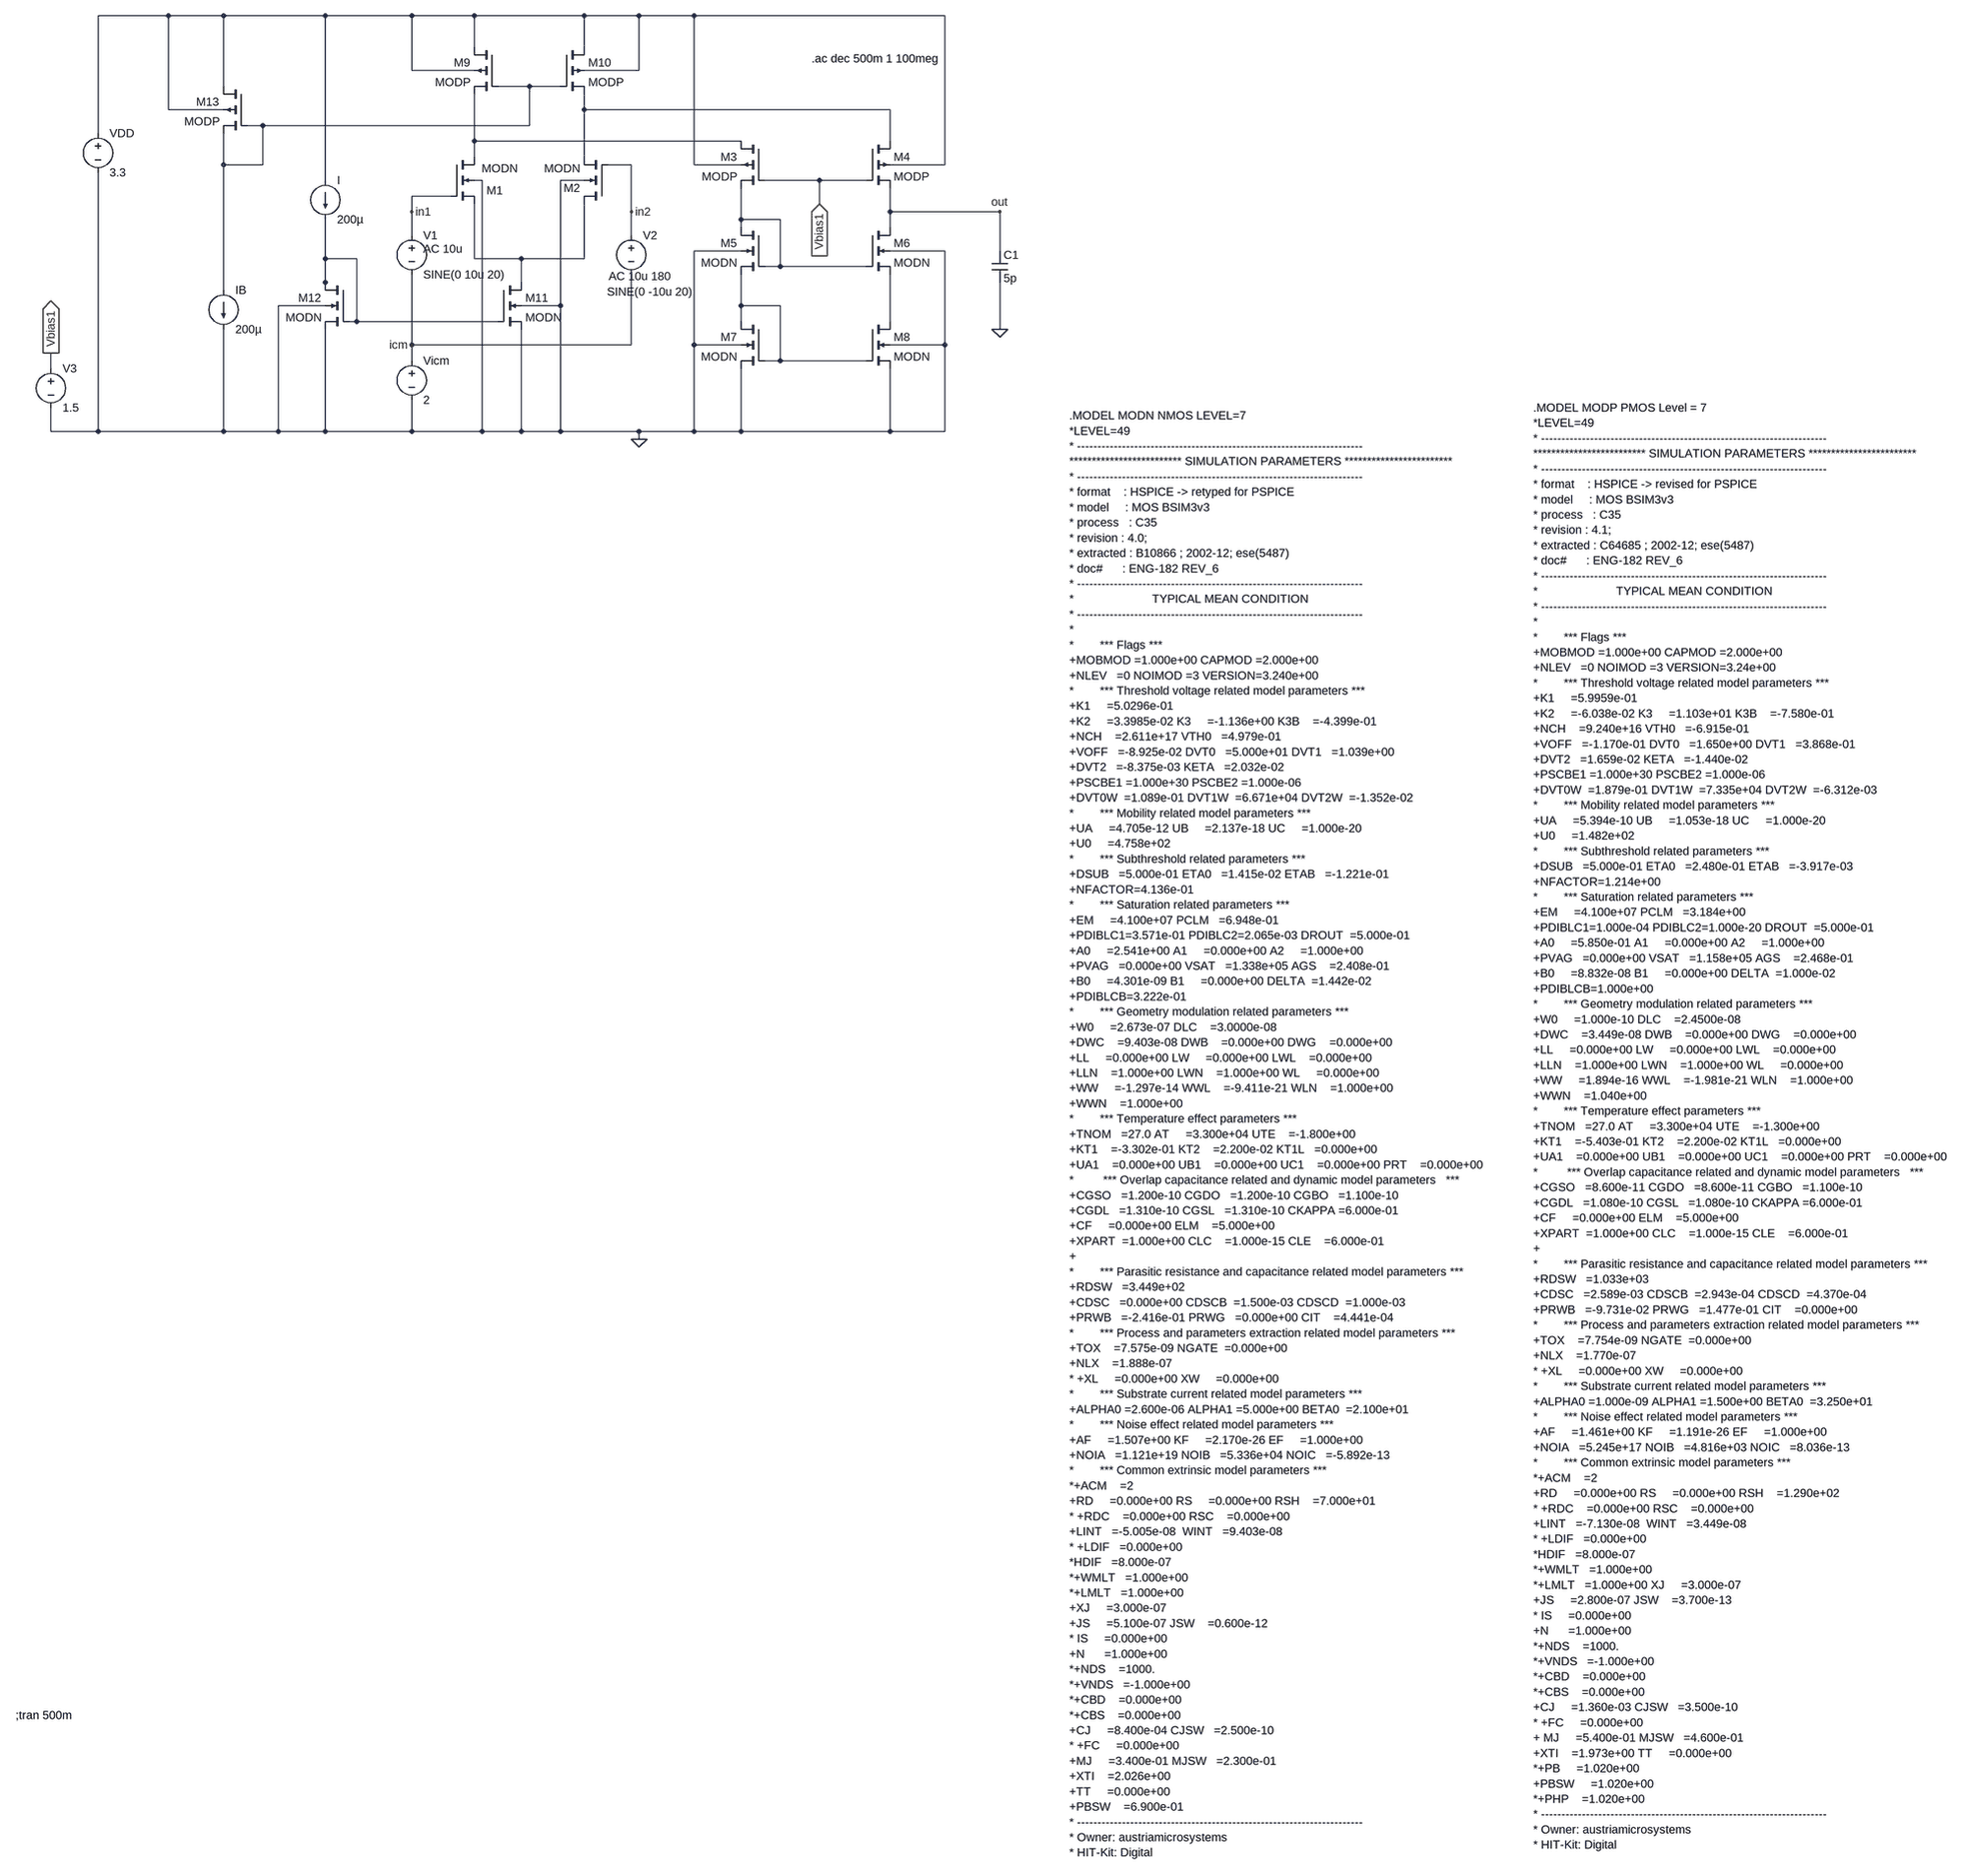
[diagram p0: schematic Ota.asc]
Ota.asc, the LTspice schematic file:
Version 4
SHEET 1 2256 2892
WIRE -1648 -592 -1792 -592
WIRE -1536 -592 -1648 -592
WIRE -1328 -592 -1536 -592
WIRE -1152 -592 -1328 -592
WIRE -1024 -592 -1152 -592
WIRE -800 -592 -1024 -592
WIRE -688 -592 -800 -592
WIRE -576 -592 -688 -592
WIRE -64 -592 -576 -592
WIRE -1024 -528 -1024 -592
WIRE -800 -528 -800 -592
WIRE -1152 -480 -1152 -592
WIRE -1024 -480 -1152 -480
WIRE -688 -480 -688 -592
WIRE -688 -480 -800 -480
WIRE -1536 -448 -1536 -592
WIRE -912 -448 -976 -448
WIRE -848 -448 -912 -448
WIRE -1648 -400 -1648 -592
WIRE -1536 -400 -1648 -400
WIRE -800 -400 -800 -432
WIRE -176 -400 -800 -400
WIRE -1456 -368 -1488 -368
WIRE -912 -368 -912 -448
WIRE -912 -368 -1456 -368
WIRE -1792 -352 -1792 -592
WIRE -1024 -336 -1024 -432
WIRE -480 -336 -1024 -336
WIRE -176 -336 -176 -400
WIRE -1024 -304 -1024 -336
WIRE -800 -304 -800 -400
WIRE -1536 -288 -1536 -352
WIRE -1456 -288 -1456 -368
WIRE -1456 -288 -1536 -288
WIRE -704 -288 -752 -288
WIRE -576 -288 -576 -592
WIRE -480 -288 -576 -288
WIRE -64 -288 -64 -592
WIRE -64 -288 -176 -288
WIRE -1328 -256 -1328 -592
WIRE -1008 -256 -1024 -256
WIRE -800 -256 -848 -256
WIRE -320 -256 -432 -256
WIRE -224 -256 -320 -256
WIRE -1072 -224 -1152 -224
WIRE -320 -208 -320 -256
WIRE -1152 -192 -1152 -224
WIRE -704 -192 -704 -288
WIRE -176 -192 -176 -240
WIRE 48 -192 -176 -192
WIRE -480 -176 -480 -240
WIRE -400 -176 -480 -176
WIRE -480 -160 -480 -176
WIRE -176 -160 -176 -192
WIRE -1152 -144 -1152 -192
WIRE -704 -144 -704 -192
WIRE -480 -112 -576 -112
WIRE -64 -112 -176 -112
WIRE 48 -112 48 -192
WIRE -1328 -96 -1328 -176
WIRE -1264 -96 -1328 -96
WIRE -1024 -96 -1024 -208
WIRE -928 -96 -1024 -96
WIRE -800 -96 -800 -208
WIRE -800 -96 -928 -96
WIRE -400 -80 -400 -176
WIRE -400 -80 -432 -80
WIRE -224 -80 -400 -80
WIRE -1328 -48 -1328 -96
WIRE -928 -48 -928 -96
WIRE -1536 -32 -1536 -288
WIRE -1328 -32 -1328 -48
WIRE -1328 0 -1424 0
WIRE -848 0 -848 -256
WIRE -848 0 -928 0
WIRE -480 0 -480 -64
WIRE -400 0 -480 0
WIRE -1264 32 -1264 -96
WIRE -1264 32 -1280 32
WIRE -976 32 -1264 32
WIRE -480 32 -480 0
WIRE -176 32 -176 -64
WIRE 48 48 48 -48
WIRE -1152 80 -1152 -64
WIRE -704 80 -704 -64
WIRE -704 80 -1152 80
WIRE -576 80 -576 -112
WIRE -480 80 -576 80
WIRE -64 80 -64 -112
WIRE -64 80 -176 80
WIRE -1152 112 -1152 80
WIRE -400 112 -400 0
WIRE -400 112 -432 112
WIRE -224 112 -400 112
WIRE -1888 128 -1888 96
WIRE -1888 256 -1888 208
WIRE -1792 256 -1792 -272
WIRE -1792 256 -1888 256
WIRE -1536 256 -1536 48
WIRE -1536 256 -1792 256
WIRE -1424 256 -1424 0
WIRE -1424 256 -1536 256
WIRE -1328 256 -1328 48
WIRE -1328 256 -1424 256
WIRE -1152 256 -1152 192
WIRE -1152 256 -1328 256
WIRE -1008 256 -1008 -256
WIRE -1008 256 -1152 256
WIRE -928 256 -928 48
WIRE -928 256 -1008 256
WIRE -848 256 -848 0
WIRE -848 256 -928 256
WIRE -688 256 -848 256
WIRE -576 256 -576 80
WIRE -576 256 -688 256
WIRE -480 256 -480 128
WIRE -480 256 -576 256
WIRE -176 256 -176 128
WIRE -176 256 -480 256
WIRE -64 256 -64 80
WIRE -64 256 -176 256
WIRE -688 272 -688 256
FLAG -688 272 0
FLAG -320 -208 Vbias1
IOPIN -320 -208 In
FLAG 48 -192 out
FLAG -1888 96 Vbias1
IOPIN -1888 96 Out
FLAG 48 48 0
FLAG -704 -192 in2
FLAG -1152 -192 in1
FLAG -1152 80 icm
SYMBOL nmos4 -752 -208 R180
SYMATTR InstName M2
SYMATTR Value MODN
SYMATTR Value2 l=1.4u w=44.8u
SYMBOL nmos4 -1072 -304 R0
WINDOW 0 73 69 Left 2
WINDOW 3 63 24 Left 2
SYMATTR InstName M1
SYMATTR Value MODN
SYMATTR Value2 l=1.4u w=44.8u
SYMBOL pmos4 -224 -336 R0
SYMATTR InstName M4
SYMATTR Value MODP
SYMATTR Value2 l=1.4u w=168u
SYMBOL nmos4 -224 -160 R0
SYMATTR InstName M6
SYMATTR Value MODN
SYMATTR Value2 l=1.4u w=67.2u
SYMBOL nmos4 -224 32 R0
SYMATTR InstName M8
SYMATTR Value MODN
SYMATTR Value2 l=1.4u w=67.2u
SYMBOL pmos4 -848 -528 R0
SYMATTR InstName M10
SYMATTR Value MODP
SYMATTR Value2 l=1.4u w=280u
SYMBOL nmos4 -976 -48 R0
SYMATTR InstName M11
SYMATTR Value MODN
SYMATTR Value2 l=1.4u w=89.6u
SYMBOL voltage -1792 -368 R0
WINDOW 123 0 0 Left 2
WINDOW 39 0 0 Left 2
SYMATTR InstName VDD
SYMATTR Value 3.3
SYMBOL pmos4 -432 -336 M0
SYMATTR InstName M3
SYMATTR Value MODP
SYMATTR Value2 l=1.4u w=168u
SYMBOL pmos4 -976 -528 M0
SYMATTR InstName M9
SYMATTR Value MODP
SYMATTR Value2 l=1.4u w=280u
SYMBOL nmos4 -432 -160 M0
SYMATTR InstName M5
SYMATTR Value MODN
SYMATTR Value2 l=1.4u w=67.2u
SYMBOL nmos4 -432 32 M0
SYMATTR InstName M7
SYMATTR Value MODN
SYMATTR Value2 l=1.4u w=67.2u
SYMBOL nmos4 -1280 -48 M0
SYMATTR InstName M12
SYMATTR Value MODN
SYMATTR Value2 l=1.4u w=89.6u
SYMBOL current -1328 -256 R0
WINDOW 123 0 0 Left 2
WINDOW 39 0 0 Left 2
SYMATTR InstName I
SYMATTR Value 200µ
SYMBOL pmos4 -1488 -448 M0
SYMATTR InstName M13
SYMATTR Value MODP
SYMATTR Value2 l=1.4u w=280u
SYMBOL current -1536 -32 R0
WINDOW 123 0 0 Left 2
WINDOW 39 0 0 Left 2
SYMATTR InstName IB
SYMATTR Value 200µ
SYMBOL voltage -1152 96 R0
WINDOW 123 24 124 Left 2
WINDOW 39 0 0 Left 2
SYMATTR InstName Vicm
SYMATTR Value 2
SYMBOL voltage -1152 -160 R0
WINDOW 123 24 44 Left 2
WINDOW 39 0 0 Left 2
SYMATTR InstName V1
SYMATTR Value SINE(0 10u 20)
SYMATTR Value2 AC 10u
SYMBOL voltage -704 -160 R0
WINDOW 3 -49 131 Left 2
WINDOW 123 -46 100 Left 2
WINDOW 39 0 0 Left 2
SYMATTR InstName V2
SYMATTR Value SINE(0 -10u 20)
SYMATTR Value2 AC 10u 180
SYMBOL voltage -1888 112 R0
SYMATTR InstName V3
SYMATTR Value 1.5
SYMBOL cap 32 -112 R0
SYMATTR InstName C1
SYMATTR Value 5p
TEXT 448 224 Left 2 !.MODEL MODN NMOS LEVEL=7\n*LEVEL=49 \n* ----------------------------------------------------------------------\n************************* SIMULATION PARAMETERS ************************\n* ----------------------------------------------------------------------\n* format    : HSPICE -> retyped for PSPICE\n* model     : MOS BSIM3v3\n* process   : C35\n* revision : 4.0; \n* extracted : B10866 ; 2002-12; ese(5487)\n* doc#      : ENG-182 REV_6\n* ----------------------------------------------------------------------\n*                        TYPICAL MEAN CONDITION\n* ----------------------------------------------------------------------\n*\n*        *** Flags ***\n+MOBMOD =1.000e+00 CAPMOD =2.000e+00 \n+NLEV   =0 NOIMOD =3 VERSION=3.240e+00 \n*        *** Threshold voltage related model parameters ***\n+K1     =5.0296e-01 \n+K2     =3.3985e-02 K3     =-1.136e+00 K3B    =-4.399e-01 \n+NCH    =2.611e+17 VTH0   =4.979e-01 \n+VOFF   =-8.925e-02 DVT0   =5.000e+01 DVT1   =1.039e+00 \n+DVT2   =-8.375e-03 KETA   =2.032e-02 \n+PSCBE1 =1.000e+30 PSCBE2 =1.000e-06 \n+DVT0W  =1.089e-01 DVT1W  =6.671e+04 DVT2W  =-1.352e-02 \n*        *** Mobility related model parameters ***\n+UA     =4.705e-12 UB     =2.137e-18 UC     =1.000e-20 \n+U0     =4.758e+02 \n*        *** Subthreshold related parameters ***\n+DSUB   =5.000e-01 ETA0   =1.415e-02 ETAB   =-1.221e-01 \n+NFACTOR=4.136e-01 \n*        *** Saturation related parameters ***\n+EM     =4.100e+07 PCLM   =6.948e-01 \n+PDIBLC1=3.571e-01 PDIBLC2=2.065e-03 DROUT  =5.000e-01 \n+A0     =2.541e+00 A1     =0.000e+00 A2     =1.000e+00 \n+PVAG   =0.000e+00 VSAT   =1.338e+05 AGS    =2.408e-01 \n+B0     =4.301e-09 B1     =0.000e+00 DELTA  =1.442e-02 \n+PDIBLCB=3.222e-01 \n*        *** Geometry modulation related parameters ***\n+W0     =2.673e-07 DLC    =3.0000e-08 \n+DWC    =9.403e-08 DWB    =0.000e+00 DWG    =0.000e+00 \n+LL     =0.000e+00 LW     =0.000e+00 LWL    =0.000e+00 \n+LLN    =1.000e+00 LWN    =1.000e+00 WL     =0.000e+00 \n+WW     =-1.297e-14 WWL    =-9.411e-21 WLN    =1.000e+00 \n+WWN    =1.000e+00 \n*        *** Temperature effect parameters ***\n+TNOM   =27.0 AT     =3.300e+04 UTE    =-1.800e+00 \n+KT1    =-3.302e-01 KT2    =2.200e-02 KT1L   =0.000e+00 \n+UA1    =0.000e+00 UB1    =0.000e+00 UC1    =0.000e+00 PRT    =0.000e+00 \n*         *** Overlap capacitance related and dynamic model parameters   ***\n+CGSO   =1.200e-10 CGDO   =1.200e-10 CGBO   =1.100e-10 \n+CGDL   =1.310e-10 CGSL   =1.310e-10 CKAPPA =6.000e-01 \n+CF     =0.000e+00 ELM    =5.000e+00 \n+XPART  =1.000e+00 CLC    =1.000e-15 CLE    =6.000e-01 \n+\n*        *** Parasitic resistance and capacitance related model parameters ***\n+RDSW   =3.449e+02 \n+CDSC   =0.000e+00 CDSCB  =1.500e-03 CDSCD  =1.000e-03 \n+PRWB   =-2.416e-01 PRWG   =0.000e+00 CIT    =4.441e-04 \n*        *** Process and parameters extraction related model parameters ***\n+TOX    =7.575e-09 NGATE  =0.000e+00 \n+NLX    =1.888e-07 \n* +XL     =0.000e+00 XW     =0.000e+00 \n*        *** Substrate current related model parameters ***\n+ALPHA0 =2.600e-06 ALPHA1 =5.000e+00 BETA0  =2.100e+01 \n*        *** Noise effect related model parameters ***\n+AF     =1.507e+00 KF     =2.170e-26 EF     =1.000e+00 \n+NOIA   =1.121e+19 NOIB   =5.336e+04 NOIC   =-5.892e-13 \n*        *** Common extrinsic model parameters ***\n*+ACM    =2        \n+RD     =0.000e+00 RS     =0.000e+00 RSH    =7.000e+01 \n* +RDC    =0.000e+00 RSC    =0.000e+00 \n+LINT   =-5.005e-08  WINT   =9.403e-08 \n* +LDIF   =0.000e+00 \n*HDIF   =8.000e-07\n*+WMLT   =1.000e+00 \n*+LMLT   =1.000e+00 \n+XJ     =3.000e-07 \n+JS     =5.100e-07 JSW    =0.600e-12 \n* IS     =0.000e+00 \n+N      =1.000e+00 \n*+NDS    =1000. \n*+VNDS   =-1.000e+00 \n*+CBD    =0.000e+00 \n*+CBS    =0.000e+00 \n+CJ     =8.400e-04 CJSW   =2.500e-10 \n* +FC     =0.000e+00 \n+MJ     =3.400e-01 MJSW   =2.300e-01 \n+XTI    =2.026e+00 \n+TT     =0.000e+00 \n+PBSW    =6.900e-01 \n* ----------------------------------------------------------------------\n* Owner: austriamicrosystems\n* HIT-Kit: Digital
TEXT 1408 208 Left 2 !.MODEL MODP PMOS Level = 7\n*LEVEL=49 \n* ----------------------------------------------------------------------\n************************* SIMULATION PARAMETERS ************************\n* ----------------------------------------------------------------------\n* format    : HSPICE -> revised for PSPICE\n* model     : MOS BSIM3v3\n* process   : C35\n* revision : 4.1; \n* extracted : C64685 ; 2002-12; ese(5487)\n* doc#      : ENG-182 REV_6\n* ----------------------------------------------------------------------\n*                        TYPICAL MEAN CONDITION\n* ----------------------------------------------------------------------\n*\n*        *** Flags ***\n+MOBMOD =1.000e+00 CAPMOD =2.000e+00 \n+NLEV   =0 NOIMOD =3 VERSION=3.24e+00 \n*        *** Threshold voltage related model parameters ***\n+K1     =5.9959e-01 \n+K2     =-6.038e-02 K3     =1.103e+01 K3B    =-7.580e-01 \n+NCH    =9.240e+16 VTH0   =-6.915e-01 \n+VOFF   =-1.170e-01 DVT0   =1.650e+00 DVT1   =3.868e-01 \n+DVT2   =1.659e-02 KETA   =-1.440e-02 \n+PSCBE1 =1.000e+30 PSCBE2 =1.000e-06 \n+DVT0W  =1.879e-01 DVT1W  =7.335e+04 DVT2W  =-6.312e-03 \n*        *** Mobility related model parameters ***\n+UA     =5.394e-10 UB     =1.053e-18 UC     =1.000e-20 \n+U0     =1.482e+02 \n*        *** Subthreshold related parameters ***\n+DSUB   =5.000e-01 ETA0   =2.480e-01 ETAB   =-3.917e-03 \n+NFACTOR=1.214e+00 \n*        *** Saturation related parameters ***\n+EM     =4.100e+07 PCLM   =3.184e+00 \n+PDIBLC1=1.000e-04 PDIBLC2=1.000e-20 DROUT  =5.000e-01 \n+A0     =5.850e-01 A1     =0.000e+00 A2     =1.000e+00 \n+PVAG   =0.000e+00 VSAT   =1.158e+05 AGS    =2.468e-01 \n+B0     =8.832e-08 B1     =0.000e+00 DELTA  =1.000e-02 \n+PDIBLCB=1.000e+00 \n*        *** Geometry modulation related parameters ***\n+W0     =1.000e-10 DLC    =2.4500e-08 \n+DWC    =3.449e-08 DWB    =0.000e+00 DWG    =0.000e+00 \n+LL     =0.000e+00 LW     =0.000e+00 LWL    =0.000e+00 \n+LLN    =1.000e+00 LWN    =1.000e+00 WL     =0.000e+00 \n+WW     =1.894e-16 WWL    =-1.981e-21 WLN    =1.000e+00 \n+WWN    =1.040e+00 \n*        *** Temperature effect parameters ***\n+TNOM   =27.0 AT     =3.300e+04 UTE    =-1.300e+00 \n+KT1    =-5.403e-01 KT2    =2.200e-02 KT1L   =0.000e+00 \n+UA1    =0.000e+00 UB1    =0.000e+00 UC1    =0.000e+00 PRT    =0.000e+00 \n*         *** Overlap capacitance related and dynamic model parameters   ***\n+CGSO   =8.600e-11 CGDO   =8.600e-11 CGBO   =1.100e-10 \n+CGDL   =1.080e-10 CGSL   =1.080e-10 CKAPPA =6.000e-01 \n+CF     =0.000e+00 ELM    =5.000e+00 \n+XPART  =1.000e+00 CLC    =1.000e-15 CLE    =6.000e-01 \n+\n*        *** Parasitic resistance and capacitance related model parameters ***\n+RDSW   =1.033e+03 \n+CDSC   =2.589e-03 CDSCB  =2.943e-04 CDSCD  =4.370e-04 \n+PRWB   =-9.731e-02 PRWG   =1.477e-01 CIT    =0.000e+00 \n*        *** Process and parameters extraction related model parameters ***\n+TOX    =7.754e-09 NGATE  =0.000e+00 \n+NLX    =1.770e-07 \n* +XL     =0.000e+00 XW     =0.000e+00 \n*        *** Substrate current related model parameters ***\n+ALPHA0 =1.000e-09 ALPHA1 =1.500e+00 BETA0  =3.250e+01 \n*        *** Noise effect related model parameters ***\n+AF     =1.461e+00 KF     =1.191e-26 EF     =1.000e+00 \n+NOIA   =5.245e+17 NOIB   =4.816e+03 NOIC   =8.036e-13 \n*        *** Common extrinsic model parameters ***\n*+ACM    =2        \n+RD     =0.000e+00 RS     =0.000e+00 RSH    =1.290e+02 \n* +RDC    =0.000e+00 RSC    =0.000e+00 \n+LINT   =-7.130e-08  WINT   =3.449e-08 \n* +LDIF   =0.000e+00\n*HDIF   =8.000e-07 \n*+WMLT   =1.000e+00 \n*+LMLT   =1.000e+00 XJ     =3.000e-07 \n+JS     =2.800e-07 JSW    =3.700e-13 \n* IS     =0.000e+00 \n+N      =1.000e+00 \n*+NDS    =1000. \n*+VNDS   =-1.000e+00 \n*+CBD    =0.000e+00 \n*+CBS    =0.000e+00 \n+CJ     =1.360e-03 CJSW   =3.500e-10 \n* +FC     =0.000e+00 \n+ MJ     =5.400e-01 MJSW   =4.600e-01 \n+XTI    =1.973e+00 TT     =0.000e+00 \n*+PB     =1.020e+00 \n+PBSW     =1.020e+00\n*+PHP    =1.020e+00 \n* ----------------------------------------------------------------------\n* Owner: austriamicrosystems\n* HIT-Kit: Digital
TEXT -1960 2876 Left 2 !;tran 500m
TEXT -336 -504 Left 2 !.ac dec 500m 1 100meg

The netlist it stands for:
* Ota.asc
M2 N007 in2 N003 0 MODN l=1.4u w=44.8u
M1 N004 in1 N007 0 MODN l=1.4u w=44.8u
M4 N003 Vbias1 out N001 MODP l=1.4u w=168u
M6 out N005 N009 0 MODN l=1.4u w=67.2u
M8 N009 N008 0 0 MODN l=1.4u w=67.2u
M10 N001 N002 N003 N001 MODP l=1.4u w=280u
M11 N007 N006 0 0 MODN l=1.4u w=89.6u
VDD N001 0 3.3
M3 N004 Vbias1 N005 N001 MODP l=1.4u w=168u
M9 N001 N002 N004 N001 MODP l=1.4u w=280u
M5 N005 N005 N008 0 MODN l=1.4u w=67.2u
M7 N008 N008 0 0 MODN l=1.4u w=67.2u
M12 N006 N006 0 0 MODN l=1.4u w=89.6u
I N001 N006 200µ
M13 N001 N002 N002 N001 MODP l=1.4u w=280u
IB N002 0 200µ
Vicm icm 0 2
V1 in1 icm SINE(0 10u 20) AC 10u
V2 in2 icm SINE(0 -10u 20) AC 10u 180
V3 Vbias1 0 1.5
C1 out 0 5p
.model NMOS NMOS
.model PMOS PMOS
.lib standard.mos
.MODEL MODN NMOS LEVEL=7
*LEVEL=49
* ----------------------------------------------------------------------
************************* SIMULATION PARAMETERS ************************
* ----------------------------------------------------------------------
* format    : HSPICE -> retyped for PSPICE
* model     : MOS BSIM3v3
* process   : C35
* revision : 4.0;
* extracted : B10866 ; 2002-12; ese(5487)
* doc#      : ENG-182 REV_6
* ----------------------------------------------------------------------
*                        TYPICAL MEAN CONDITION
* ----------------------------------------------------------------------
*
*        *** Flags ***
+MOBMOD =1.000e+00 CAPMOD =2.000e+00
+NLEV   =0 NOIMOD =3 VERSION=3.240e+00
*        *** Threshold voltage related model parameters ***
+K1     =5.0296e-01
+K2     =3.3985e-02 K3     =-1.136e+00 K3B    =-4.399e-01
+NCH    =2.611e+17 VTH0   =4.979e-01
+VOFF   =-8.925e-02 DVT0   =5.000e+01 DVT1   =1.039e+00
+DVT2   =-8.375e-03 KETA   =2.032e-02
+PSCBE1 =1.000e+30 PSCBE2 =1.000e-06
+DVT0W  =1.089e-01 DVT1W  =6.671e+04 DVT2W  =-1.352e-02
*        *** Mobility related model parameters ***
+UA     =4.705e-12 UB     =2.137e-18 UC     =1.000e-20
+U0     =4.758e+02
*        *** Subthreshold related parameters ***
+DSUB   =5.000e-01 ETA0   =1.415e-02 ETAB   =-1.221e-01
+NFACTOR=4.136e-01
*        *** Saturation related parameters ***
+EM     =4.100e+07 PCLM   =6.948e-01
+PDIBLC1=3.571e-01 PDIBLC2=2.065e-03 DROUT  =5.000e-01
+A0     =2.541e+00 A1     =0.000e+00 A2     =1.000e+00
+PVAG   =0.000e+00 VSAT   =1.338e+05 AGS    =2.408e-01
+B0     =4.301e-09 B1     =0.000e+00 DELTA  =1.442e-02
+PDIBLCB=3.222e-01
*        *** Geometry modulation related parameters ***
+W0     =2.673e-07 DLC    =3.0000e-08
+DWC    =9.403e-08 DWB    =0.000e+00 DWG    =0.000e+00
+LL     =0.000e+00 LW     =0.000e+00 LWL    =0.000e+00
+LLN    =1.000e+00 LWN    =1.000e+00 WL     =0.000e+00
+WW     =-1.297e-14 WWL    =-9.411e-21 WLN    =1.000e+00
+WWN    =1.000e+00
*        *** Temperature effect parameters ***
+TNOM   =27.0 AT     =3.300e+04 UTE    =-1.800e+00
+KT1    =-3.302e-01 KT2    =2.200e-02 KT1L   =0.000e+00
+UA1    =0.000e+00 UB1    =0.000e+00 UC1    =0.000e+00 PRT    =0.000e+00
*         *** Overlap capacitance related and dynamic model parameters   ***
+CGSO   =1.200e-10 CGDO   =1.200e-10 CGBO   =1.100e-10
+CGDL   =1.310e-10 CGSL   =1.310e-10 CKAPPA =6.000e-01
+CF     =0.000e+00 ELM    =5.000e+00
+XPART  =1.000e+00 CLC    =1.000e-15 CLE    =6.000e-01
+
*        *** Parasitic resistance and capacitance related model parameters ***
+RDSW   =3.449e+02
+CDSC   =0.000e+00 CDSCB  =1.500e-03 CDSCD  =1.000e-03
+PRWB   =-2.416e-01 PRWG   =0.000e+00 CIT    =4.441e-04
*        *** Process and parameters extraction related model parameters ***
+TOX    =7.575e-09 NGATE  =0.000e+00
+NLX    =1.888e-07
* +XL     =0.000e+00 XW     =0.000e+00
*        *** Substrate current related model parameters ***
+ALPHA0 =2.600e-06 ALPHA1 =5.000e+00 BETA0  =2.100e+01
*        *** Noise effect related model parameters ***
+AF     =1.507e+00 KF     =2.170e-26 EF     =1.000e+00
+NOIA   =1.121e+19 NOIB   =5.336e+04 NOIC   =-5.892e-13
*        *** Common extrinsic model parameters ***
*+ACM    =2
+RD     =0.000e+00 RS     =0.000e+00 RSH    =7.000e+01
* +RDC    =0.000e+00 RSC    =0.000e+00
+LINT   =-5.005e-08  WINT   =9.403e-08
* +LDIF   =0.000e+00
*HDIF   =8.000e-07
*+WMLT   =1.000e+00
*+LMLT   =1.000e+00
+XJ     =3.000e-07
+JS     =5.100e-07 JSW    =0.600e-12
* IS     =0.000e+00
+N      =1.000e+00
*+NDS    =1000.
*+VNDS   =-1.000e+00
*+CBD    =0.000e+00
*+CBS    =0.000e+00
+CJ     =8.400e-04 CJSW   =2.500e-10
* +FC     =0.000e+00
+MJ     =3.400e-01 MJSW   =2.300e-01
+XTI    =2.026e+00
+TT     =0.000e+00
+PBSW    =6.900e-01
* ----------------------------------------------------------------------
* Owner: austriamicrosystems
* HIT-Kit: Digital
.MODEL MODP PMOS Level = 7
*LEVEL=49
* ----------------------------------------------------------------------
************************* SIMULATION PARAMETERS ************************
* ----------------------------------------------------------------------
* format    : HSPICE -> revised for PSPICE
* model     : MOS BSIM3v3
* process   : C35
* revision : 4.1;
* extracted : C64685 ; 2002-12; ese(5487)
* doc#      : ENG-182 REV_6
* ----------------------------------------------------------------------
*                        TYPICAL MEAN CONDITION
* ----------------------------------------------------------------------
*
*        *** Flags ***
+MOBMOD =1.000e+00 CAPMOD =2.000e+00
+NLEV   =0 NOIMOD =3 VERSION=3.24e+00
*        *** Threshold voltage related model parameters ***
+K1     =5.9959e-01
+K2     =-6.038e-02 K3     =1.103e+01 K3B    =-7.580e-01
+NCH    =9.240e+16 VTH0   =-6.915e-01
+VOFF   =-1.170e-01 DVT0   =1.650e+00 DVT1   =3.868e-01
+DVT2   =1.659e-02 KETA   =-1.440e-02
+PSCBE1 =1.000e+30 PSCBE2 =1.000e-06
+DVT0W  =1.879e-01 DVT1W  =7.335e+04 DVT2W  =-6.312e-03
*        *** Mobility related model parameters ***
+UA     =5.394e-10 UB     =1.053e-18 UC     =1.000e-20
+U0     =1.482e+02
*        *** Subthreshold related parameters ***
+DSUB   =5.000e-01 ETA0   =2.480e-01 ETAB   =-3.917e-03
+NFACTOR=1.214e+00
*        *** Saturation related parameters ***
+EM     =4.100e+07 PCLM   =3.184e+00
+PDIBLC1=1.000e-04 PDIBLC2=1.000e-20 DROUT  =5.000e-01
+A0     =5.850e-01 A1     =0.000e+00 A2     =1.000e+00
+PVAG   =0.000e+00 VSAT   =1.158e+05 AGS    =2.468e-01
+B0     =8.832e-08 B1     =0.000e+00 DELTA  =1.000e-02
+PDIBLCB=1.000e+00
*        *** Geometry modulation related parameters ***
+W0     =1.000e-10 DLC    =2.4500e-08
+DWC    =3.449e-08 DWB    =0.000e+00 DWG    =0.000e+00
+LL     =0.000e+00 LW     =0.000e+00 LWL    =0.000e+00
+LLN    =1.000e+00 LWN    =1.000e+00 WL     =0.000e+00
+WW     =1.894e-16 WWL    =-1.981e-21 WLN    =1.000e+00
+WWN    =1.040e+00
*        *** Temperature effect parameters ***
+TNOM   =27.0 AT     =3.300e+04 UTE    =-1.300e+00
+KT1    =-5.403e-01 KT2    =2.200e-02 KT1L   =0.000e+00
+UA1    =0.000e+00 UB1    =0.000e+00 UC1    =0.000e+00 PRT    =0.000e+00
*         *** Overlap capacitance related and dynamic model parameters   ***
+CGSO   =8.600e-11 CGDO   =8.600e-11 CGBO   =1.100e-10
+CGDL   =1.080e-10 CGSL   =1.080e-10 CKAPPA =6.000e-01
+CF     =0.000e+00 ELM    =5.000e+00
+XPART  =1.000e+00 CLC    =1.000e-15 CLE    =6.000e-01
+
*        *** Parasitic resistance and capacitance related model parameters ***
+RDSW   =1.033e+03
+CDSC   =2.589e-03 CDSCB  =2.943e-04 CDSCD  =4.370e-04
+PRWB   =-9.731e-02 PRWG   =1.477e-01 CIT    =0.000e+00
*        *** Process and parameters extraction related model parameters ***
+TOX    =7.754e-09 NGATE  =0.000e+00
+NLX    =1.770e-07
* +XL     =0.000e+00 XW     =0.000e+00
*        *** Substrate current related model parameters ***
+ALPHA0 =1.000e-09 ALPHA1 =1.500e+00 BETA0  =3.250e+01
*        *** Noise effect related model parameters ***
+AF     =1.461e+00 KF     =1.191e-26 EF     =1.000e+00
+NOIA   =5.245e+17 NOIB   =4.816e+03 NOIC   =8.036e-13
*        *** Common extrinsic model parameters ***
*+ACM    =2
+RD     =0.000e+00 RS     =0.000e+00 RSH    =1.290e+02
* +RDC    =0.000e+00 RSC    =0.000e+00
+LINT   =-7.130e-08  WINT   =3.449e-08
* +LDIF   =0.000e+00
*HDIF   =8.000e-07
*+WMLT   =1.000e+00
*+LMLT   =1.000e+00 XJ     =3.000e-07
+JS     =2.800e-07 JSW    =3.700e-13
* IS     =0.000e+00
+N      =1.000e+00
*+NDS    =1000.
*+VNDS   =-1.000e+00
*+CBD    =0.000e+00
*+CBS    =0.000e+00
+CJ     =1.360e-03 CJSW   =3.500e-10
* +FC     =0.000e+00
+ MJ     =5.400e-01 MJSW   =4.600e-01
+XTI    =1.973e+00 TT     =0.000e+00
*+PB     =1.020e+00
+PBSW     =1.020e+00
*+PHP    =1.020e+00
* ----------------------------------------------------------------------
* Owner: austriamicrosystems
* HIT-Kit: Digital
;tran 500m
.ac dec 500m 1 100meg
.backanno
.end